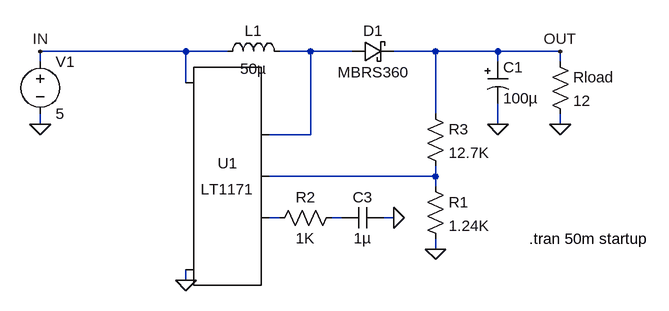
[diagram p0: schematic 1171.asc]
1171.asc, the LTspice schematic file:
Version 4
SHEET 1 2984 1464
WIRE 1824 896 1600 896
WIRE 1888 896 1824 896
WIRE 2016 896 1968 896
WIRE 2080 896 2016 896
WIRE 2208 896 2144 896
WIRE 2304 896 2208 896
WIRE 2400 896 2304 896
WIRE 1600 912 1600 896
WIRE 2304 912 2304 896
WIRE 2400 912 2400 896
WIRE 1824 944 1824 896
WIRE 2208 992 2208 896
WIRE 1600 1008 1600 992
WIRE 2304 1008 2304 976
WIRE 2400 1008 2400 992
WIRE 2016 1024 2016 896
WIRE 2016 1024 1952 1024
WIRE 2208 1088 2208 1072
WIRE 2208 1088 1952 1088
WIRE 2208 1104 2208 1088
WIRE 1968 1152 1952 1152
WIRE 2064 1152 2048 1152
WIRE 2144 1152 2128 1152
WIRE 2208 1200 2208 1184
WIRE 1824 1248 1824 1232
FLAG 2400 896 OUT
FLAG 2304 1008 0
FLAG 2208 1200 0
FLAG 1824 1248 0
FLAG 1600 1008 0
FLAG 1600 896 IN
FLAG 2144 1152 0
FLAG 2400 1008 0
SYMBOL IND 1872 912 R270
WINDOW 0 32 56 VTop 0
WINDOW 3 5 56 VBottom 0
SYMATTR InstName L1
SYMATTR Value 50µ
SYMATTR SpiceLine Rser=0.02 Rpar=5000
SYMBOL schottky 2080 912 R270
WINDOW 0 32 32 VTop 0
WINDOW 3 0 32 VBottom 0
SYMATTR InstName D1
SYMATTR Value MBRS360
SYMBOL polcap 2288 912 R0
SYMATTR InstName C1
SYMATTR Value 100µ
SYMATTR SpiceLine Rser=0.05
SYMBOL VOLTAGE 1600 896 R0
SYMATTR InstName V1
SYMATTR Value 5
SYMBOL POWERPRODUCTS\\LT1171 1824 1088 R0
SYMATTR InstName U1
SYMBOL res 2192 1088 R0
SYMATTR InstName R1
SYMATTR Value 1.24K
SYMBOL cap 2064 1168 R270
WINDOW 0 32 32 VTop 0
WINDOW 3 0 32 VBottom 0
SYMATTR InstName C3
SYMATTR Value 1µ
SYMBOL res 2064 1136 R90
WINDOW 0 0 56 VBottom 0
WINDOW 3 32 56 VTop 0
SYMATTR InstName R2
SYMATTR Value 1K
SYMBOL res 2192 976 R0
SYMATTR InstName R3
SYMATTR Value 12.7K
SYMBOL res 2384 896 R0
SYMATTR InstName Rload
SYMATTR Value 12
TEXT 2352 1184 Left 0 !.tran 50m startup

The netlist it stands for:
* 1171.asc
L1 IN N001 50µ Rser=0.02 Rpar=5000
D1 N001 OUT MBRS360
C1 OUT 0 100µ Rser=0.05
V1 IN 0 5
XU1 N003 N002 0 N001 IN LT1171
R1 N002 0 1.24K
C3 N004 0 1µ
R2 N004 N003 1K
R3 OUT N002 12.7K
Rload OUT 0 12
.model D D
.lib standard.dio
.tran 50m startup
.lib LT1171.sub
.backanno
.end